# Altium schematic sheet Sheet2.SchDoc: Ulticontroller
size A3; CompanyName: Ultimaker; DrawnBy: Coen de Boer; Engineer: Coen de Boer; Revision: 1994-E
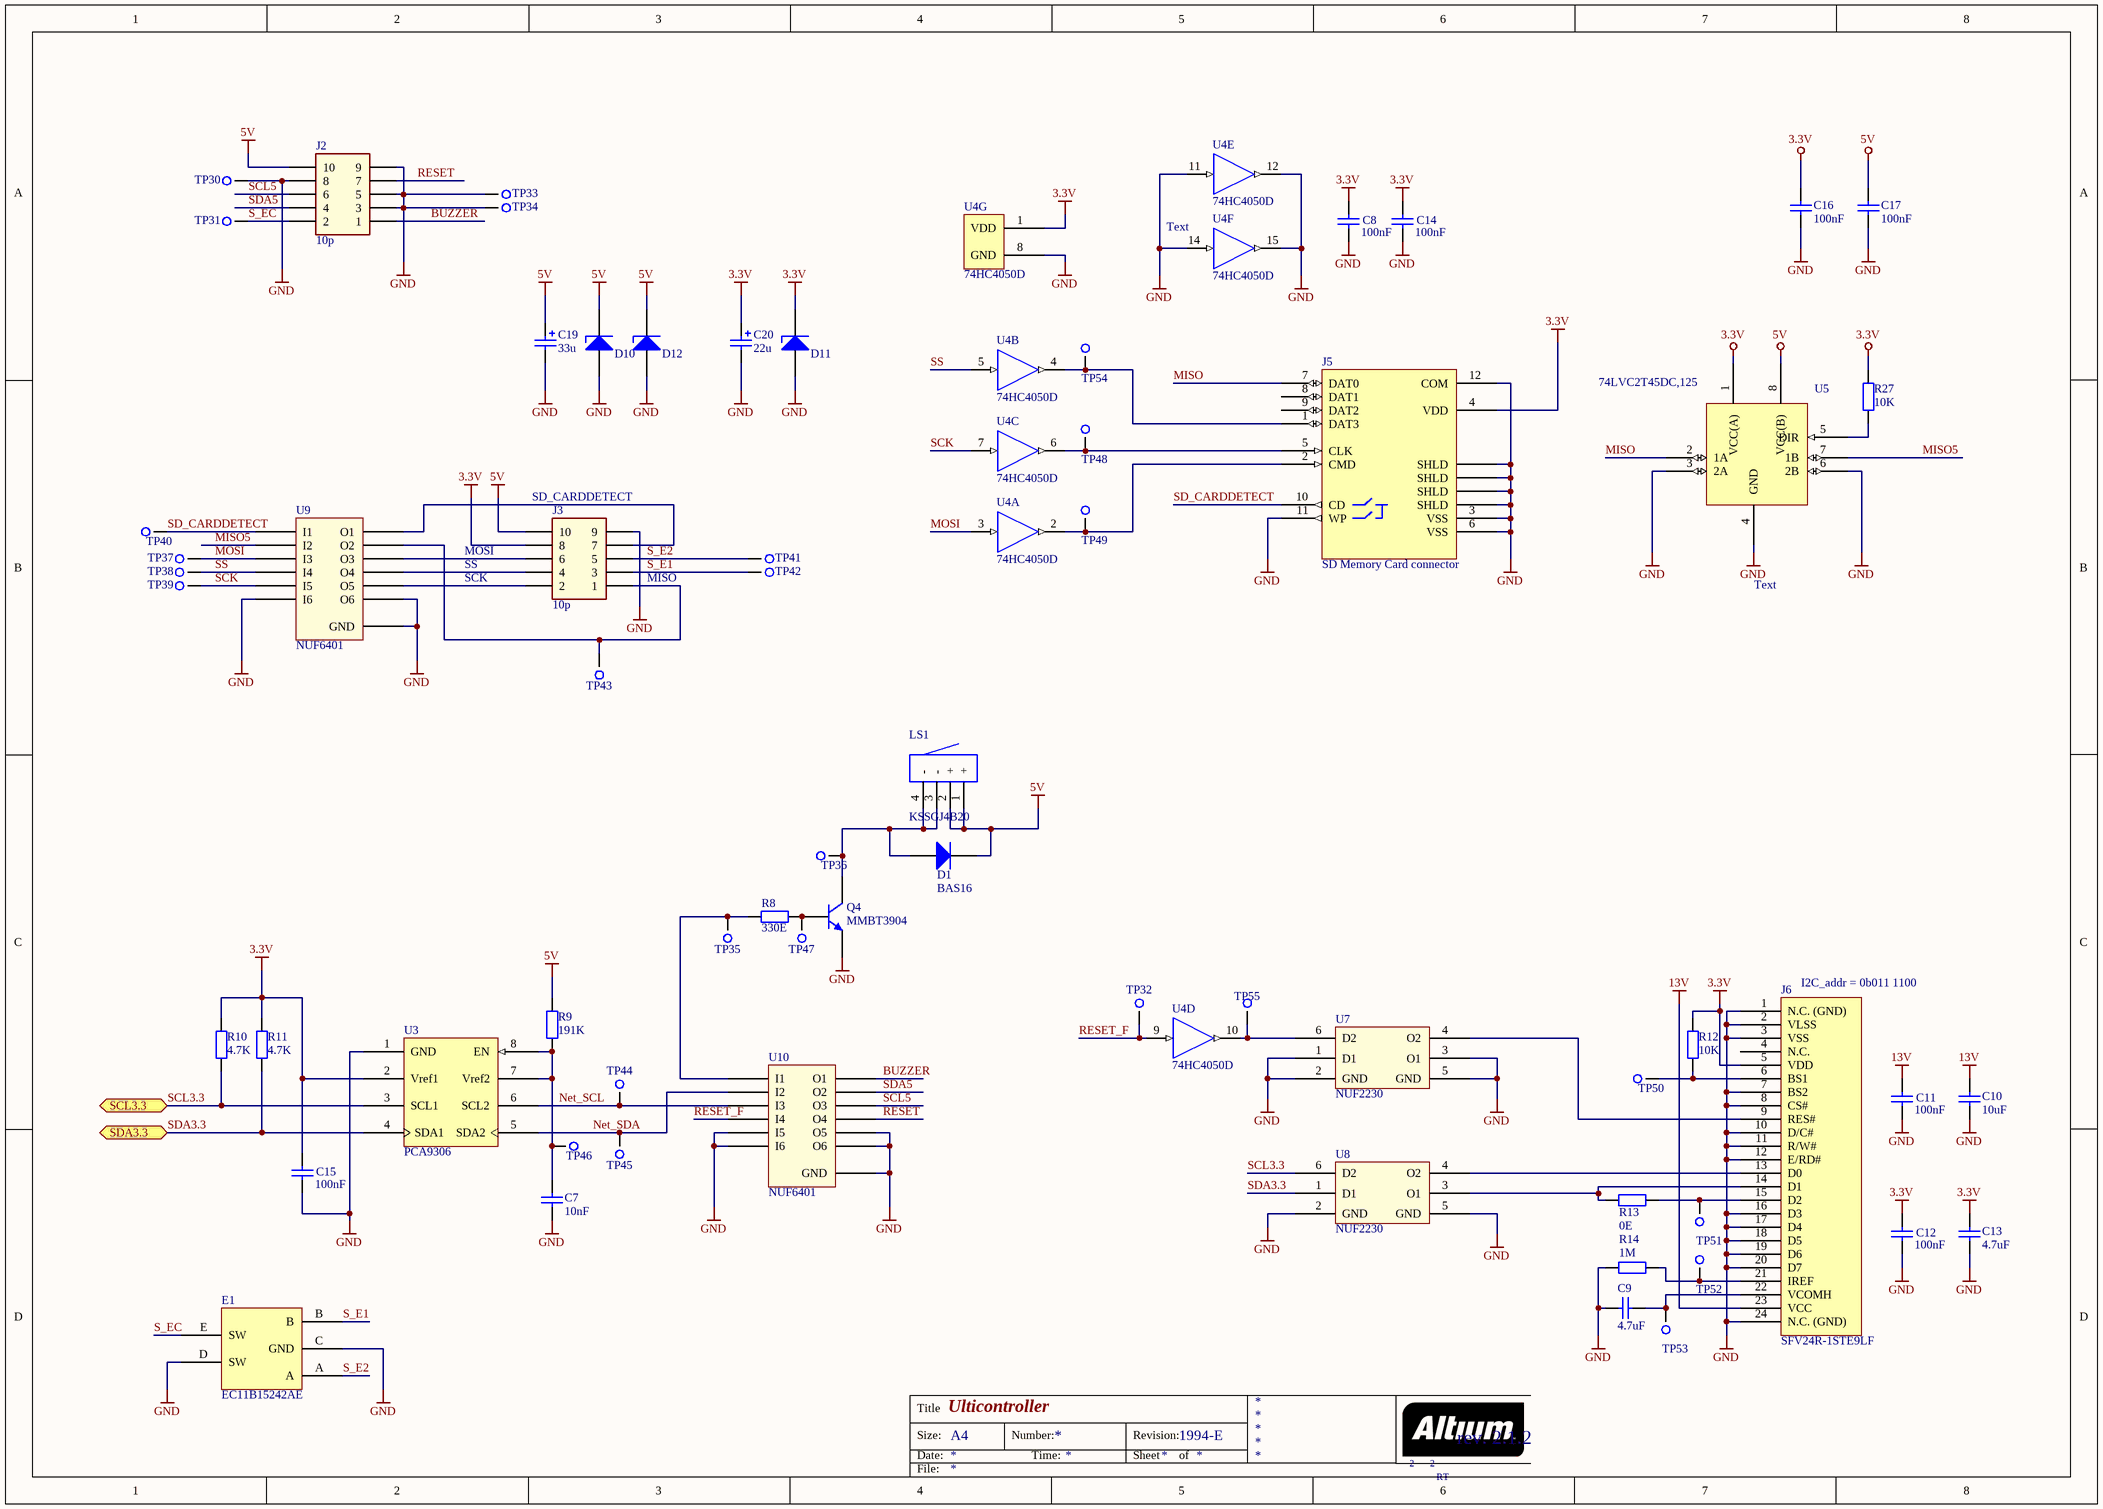
[diagram p0: Sheet2.SchDoc]

## Parts
C7  10nF  [C0805 (2012)]
C8  100nF  [C0805 (2012)]
C9  4.7uF  [C1206 (3216)]
C10  10uF  [C1206 (3216)]
C11  100nF  [C0805 (2012)]
C12  100nF  [C0805 (2012)]
C13  4.7uF  [C1206 (3216)]
C14  100nF  [C0805 (2012)]
C15  100nF  [C0805 (2012)]
C16  100nF  [C0805 (2012)]
C17  100nF  [C0805 (2012)]
C19  33u  [CAPAE5543X61M]
C20  22u  [CAPAE5543X61M]
D1  BAS16  [IC SOT23]
D10  ESD9X5.0ST5G  [SODFL100X40-2N]  (value not drawn)
D11  ESD9X3.3ST5G  [SODFL100X40-2N]  (value not drawn)
D12  ESD9X5.0ST5G  [SODFL100X40-2N]  (value not drawn)
E1  EC11B15242AE  [Misc EC11B15242AE]
J2  10p  [HEADER 10P right angle]
J3  10p  [HEADER 10P right angle]
J5  SD Memory Card connector  [CON SD-Card]
J6  SFV24R-1STE9LF  [Con SFV24R-1STE9LF]
LS1  KSSGJ4B20  [Buzzer KSSGJ4B20]
Q4  MMBT3904  [IC SOT23]
R8  330E  [R0805 (2012)]
R9  191K  [R0805 (2012)]
R10  4.7K  [R0805 (2012)]
R11  4.7K  [R0805 (2012)]
R12  10K  [R0805 (2012)]
R13  0E  [R0805 (2012)]
R14  1M  [R0805 (2012)]
R27  10K  [R0805 (2012)]
TP30  2mm  [TESTPOINT 2mm]  (value not drawn)  (no BOM)
TP31  2mm  [TESTPOINT 2mm]  (value not drawn)  (no BOM)
TP32  2mm  [TESTPOINT 2mm]  (value not drawn)  (no BOM)
TP33  2mm  [TESTPOINT 2mm]  (value not drawn)  (no BOM)
TP34  2mm  [TESTPOINT 2mm]  (value not drawn)  (no BOM)
TP35  2mm  [TESTPOINT 2mm]  (value not drawn)  (no BOM)
TP36  2mm  [TESTPOINT 2mm]  (value not drawn)  (no BOM)
TP37  2mm  [TESTPOINT 2mm]  (value not drawn)  (no BOM)
TP38  2mm  [TESTPOINT 2mm]  (value not drawn)  (no BOM)
TP39  2mm  [TESTPOINT 2mm]  (value not drawn)  (no BOM)
TP40  2mm  [TESTPOINT 2mm]  (value not drawn)  (no BOM)
TP41  2mm  [TESTPOINT 2mm]  (value not drawn)  (no BOM)
TP42  2mm  [TESTPOINT 2mm]  (value not drawn)  (no BOM)
TP43  2mm  [TESTPOINT 2mm]  (value not drawn)  (no BOM)
TP44  2mm  [TESTPOINT 2mm]  (value not drawn)  (no BOM)
TP45  2mm  [TESTPOINT 2mm]  (value not drawn)  (no BOM)
TP46  2mm  [TESTPOINT 2mm]  (value not drawn)  (no BOM)
TP47  2mm  [TESTPOINT 2mm]  (value not drawn)  (no BOM)
TP48  2mm  [TESTPOINT 2mm]  (value not drawn)  (no BOM)
TP49  2mm  [TESTPOINT 2mm]  (value not drawn)  (no BOM)
TP50  2mm  [TESTPOINT 2mm]  (value not drawn)  (no BOM)
TP51  2mm  [TESTPOINT 2mm]  (value not drawn)  (no BOM)
TP52  2mm  [TESTPOINT 2mm]  (value not drawn)  (no BOM)
TP53  2mm  [TESTPOINT 2mm]  (value not drawn)  (no BOM)
TP54  2mm  [TESTPOINT 2mm]  (value not drawn)  (no BOM)
TP55  2mm  [TESTPOINT 2mm]  (value not drawn)  (no BOM)
U3  PCA9306  [IC SSOP-8]
U4  74HC4050D  [IC SOIC-16]  (parts A,B,C,D,E,F,G of 7)
U5  74LVC2T45DC,125  [TSSOP50P310X100-8N]
U7  NUF2230  [SOTFL50P160X60-6N]
U8  NUF2230  [SOTFL50P160X60-6N]
U9  NUF6401  [SON50P140X100_HS-13N]
U10  NUF6401  [SON50P140X100_HS-13N]

## Ports
SCL3.3 (bidir), SDA3.3 (bidir)

## Nets
3.3V: C8.2 C12.2 C13.1 C14.2 C15.2 C16.1 C20.1 D11.1(K) J3.8 J5.4(VDD) J6.5(VDD) R10.2 R11.2 R12.2 R27.2 U3.2(Vref1) U4.1(VDD) U5.1(VCC(A))
5V: C17.1 C19.1 D1.3(K) D10.1(K) D12.1(K) J2.10 J3.10 LS1.1(+) LS1.2(+) R9.2 U5.8(VCC(B))
13V: C10.2 C11.2 J6.23(VCC)
GND: C7.1 C8.1 C9.2 C10.1 C11.1 C12.1 C13.2 C14.1 C15.1 C16.2 C17.2 C19.2 C20.2 D10.2(A) D11.2(A) D12.2(A) E1.C(GND) E1.D(SW) J2.3 J2.5 J2.8 J2.9 J3.9 J5.3(VSS) J5.6(VSS) J5.11(WP) J5.12(COM) J5.A(SHLD) J5.B(SHLD) J5.C(SHLD) J5.D(SHLD) J6.1(N.C._(GND)) J6.2(VLSS) J6.3(VSS) J6.7(BS2) J6.8(CS#) J6.10(D/C#) J6.11(R/W#) J6.12(E/RD#) J6.16(D3) J6.17(D4) J6.18(D5) J6.19(D6) J6.20(D7) J6.24(N.C._(GND)) Q4.2(E) R14.1 TP30.1 TP33.1 TP34.1 U3.1(GND) U4.8(GND) U4.11(A) U4.12(Y) U4.14(A) U4.15(Y) U5.3(2A) U5.4(GND) U5.6(2B) U7.1(D1) U7.2(GND) U7.3(O1) U7.5(GND) U8.2(GND) U8.5(GND) U9.6(I6) U9.7(O6) U9.13(GND) U10.5(I5) U10.6(I6) U10.7(O6) U10.8(O5) U10.13(GND)
BUZZER: J2.1 U10.12(O1)
MISO: J5.7(DAT0) U5.2(1A)
MISO5: U5.7(1B) U9.2(I2)
MOSI: TP37.1 U4.3(A) U9.3(I3)
Net_SCL: TP44.1 U3.6(SCL2) U10.3(I3)
Net_SDA: TP45.1 U3.5(SDA2) U10.2(I2)
RESET: J2.7 U10.9(O4)
RESET_F: TP32.1 U4.9(A) U10.4(I4)
S_E1: E1.B J3.3 TP42.1
S_E2: E1.A J3.5 TP41.1
S_EC: E1.E(SW) J2.2 TP31.1
SCK: TP39.1 U4.7(A) U9.5(I5)
SCL3.3: R10.1 U3.3(SCL1) U8.6(D2) ; port SCL3.3
SCL5: J2.6 U10.10(O3)
SD_CARDDETECT: J5.10(CD) TP40.1 U9.1(I1)
SDA3.3: R11.1 U3.4(SDA1) U8.1(D1) ; port SDA3.3
SDA5: J2.4 U10.11(O2)
SS: TP38.1 U4.5(A) U9.4(I4)
NetC7_2: C7.2 R9.1 TP46.1 U3.7(Vref2) U3.8(EN)
NetC9_1: C9.1 J6.22(VCOMH) TP53.1
NetD1_1: D1.1(A) LS1.3(-) LS1.4(-) Q4.3(C) TP36.1
NetJ3_1: J3.1 TP43.1 U9.11(O2)
NetJ3_2: J3.2 U9.8(O5)
NetJ3_4: J3.4 U9.9(O4)
NetJ3_6: J3.6 U9.10(O3)
NetJ3_7: J3.7 U9.12(O1)
NetJ5_1: J5.1(DAT3) TP54.1 U4.4(Y)
NetJ5_2: J5.2(CMD) TP49.1 U4.2(Y)
NetJ5_5: J5.5(CLK) TP48.1 U4.6(Y)
NetJ6_6: J6.6(BS1) R12.1 TP50.1
NetJ6_9: J6.9(RES#) U7.4(O2)
NetJ6_13: J6.13(D0) U8.4(O2)
NetJ6_14: J6.14(D1) R13.1 U8.3(O1)
NetJ6_15: J6.15(D2) R13.2 TP51.1
NetJ6_21: J6.21(IREF) R14.2 TP52.1
NetQ4_1: Q4.1(B) R8.2 TP47.1
NetR8_1: R8.1 TP35.1 U10.1(I1)
NetR27_1: R27.1 U5.5(DIR)
NetTP55_1: TP55.1 U4.10(Y) U7.6(D2)

Not connected (* = marked no-connect by the designer): J5 8(DAT1) 9(DAT2); J6 4(N.C.)

## Notes on the sheet
- (near U4) Text
- (near J3) SD_CARDDETECT
- MOSI
- SS
- SCK
- (near J3) MISO
- Text
- (near J6) I2C_addr = 0b011 1100
- rev. 2.1.2
- 2
- RT
- Title
- Size:
- Date:
- A4
- Number:
- Time:
- Revision:
- Sheet
- of
- File:

## Library data of the parts
C7 = Cap 10nF X7R 0805: Cap 10nF X7R 0805 10% 100V; Mfg: AVX; Mfg code: 08051C103K4Z2A; Faber ItemCode: -; Max soldering temp: -; Remarks: -; Supplier: Farnell; Supplier code: 1833850; SMD: Yes; Value: 10nF
C8 C11 C12 C14-C17 = Cap 100nF X7R 0805: Cap 100nF X7R 0805 10% 100V; Mfg: AVX; Mfg code: 08051C104K4T2A; Faber ItemCode: -; Max soldering temp: -; Remarks: -; Supplier: Farnell; Supplier code: 1833888; Value: 100nF; SMD: Yes
C9 C13 = Cap 4.7uF X7R 1206: Cap 4.7uF 1206 X7R 10% 25V; Mfg: TDK; Mfg code: C3216X7R1E475K160AC; Faber ItemCode: -; Max soldering temp: -; Remarks: -; Supplier: Farnell; Supplier code: 1907356; Value: 4.7uF; SMD: Yes
C10 = Cap 10uF X7R 1206: Cap 10uF 1206 X7R 10% 25V; Mfg: KEMET; Mfg code: C1206C106K3RAC TU; Faber ItemCode: -; Max soldering temp: -; Remarks: -; Supplier: Farnell; Supplier code: 2118134; Value: 10uF; SMD: Yes
C19 = Cap 33uF: CAP ALUM 33UF 20% 10V SMD; Mfg: Panasonic Electronic Components; Mfg code: EEE-FK1A330UR; Capacitance: 33µF; Lifetime @ Temp.: 2000 Hrs @ 105°C; Polarization: Polar; Ripple Current: 67.5mA @ 120Hz; Impedance: 1.35 Ohm; Surface Mount Land Size: 0.169" L x 0.169" W (4.30mm x 4.30mm); Supplier 1: Digi-Key; Supplier Part Number 1: PCE3778TR-ND; RoHS: RoHS Compliant; Category: Capacitors; Stock: 18000; Pricing: 2000=0.07952, 4000=0.0751, 10000=0.07068, 14000=0.06847, 50000=0.06185, 100000=0.05743 (EUR); Packaging: Tape & Reel (TR); Tolerance: ±20%; Voltage Rating: 10V; ESR (Equivalent Series Resistance): -; Operating Temperature: -55°C ~ 105°C; Applications: General Purpose; Lead Spacing: -; Size / Dimension: 0.157" Dia (4.00mm); Height - Seated (Max): 0.228" (5.80mm); Mounting Type: Surface Mount; Package / Case: Radial, Can - SMD; ComponentLink1URL: http://industrial.panasonic.com/www-cgi/jvcr13pz.cgi?E+PZ+3+ABA0120+EEEFK1A330UR+7+WW; ComponentLink1Description: http://industrial.panasonic.com/www-cgi/jvcr13pz.cgi?E+PZ+3+ABA0120+EEEFK1A330UR+7+WW
C20 = Cap 22uF: CAP ALUM 22UF 20% 6.3V SMD; Mfg: Panasonic Electronic Components; Mfg code: EEV-HB0J220R; Capacitance: 22µF; Lifetime @ Temp.: 2000 Hrs @ 105°C; Polarization: Polar; Ripple Current: 26mA @ 120Hz; Surface Mount Land Size: 0.169" L x 0.169" W (4.30mm x 4.30mm); Supplier 1: Digi-Key; Supplier Part Number 1: PCE3026TR-ND; RoHS: RoHS non-compliant; Category: Capacitors; Stock: 10000; Pricing: 2000=0.06791, 4000=0.06413, 10000=0.06036 (EUR); Packaging: Tape & Reel (TR); Tolerance: ±20%; Voltage Rating: 6.3V; ESR (Equivalent Series Resistance): -; Operating Temperature: -40°C ~ 105°C; Applications: General Purpose; Impedance: -; Lead Spacing: -; Size / Dimension: 0.157" Dia (4.00mm); Height - Seated (Max): 0.228" (5.80mm); Mounting Type: Surface Mount; Package / Case: Radial, Can - SMD; ComponentLink1URL: http://media.digikey.com/pdf/Data%20Sheets/Panasonic%20Capacitors%20PDFs/EEV-HB%20(HB%20Series).pdf; ComponentLink1Description: http://media.digikey.com/pdf/Data%20Sheets/Panasonic%20Capacitors%20PDFs/EEV-HB%20(HB%20Series).pdf
D1 = Diode BAS16: Diode BAS16  SOT23 85V 215MA; Mfg: NXP; Faber ItemCode: -; Max soldering temp: -; Mfg code: BAS16; Remarks: -; SMD: Yes; Supplier: Farnell; Supplier code: 1081180; Value: -
D10 D12 = ESD9X5.0ST5G: TVS DIODE 5VWM 12.3VC SOD923; Mfg: ON Semiconductor; Type: Zener; Unidirectional Channels: 1; Voltage - Reverse Standoff (Typ): 5V (Max); Voltage - Breakdown (Min): 6.2V; Voltage - Clamping (Max) @ Ipp: 12.3V; Current - Peak Pulse (10/1000µs): 8.7A (8/20µs); Power - Peak Pulse: 107W; Power Line Protection: No; Capacitance @ Frequency: 65pF @ 1MHz; Supplier 1: Digi-Key; Supplier Part Number 1: ESD9X5.0ST5GOSTR-ND; Mfg code: ESD9X5.0ST5G; RoHS: RoHS Compliant; Category: Circuit Protection; Stock: 40000; Pricing: 8000=0.02337, 16000=0.02032, 24000=0.01829, 56000=0.01626, 200000=0.01351 (EUR); Packaging: Tape & Reel (TR); Bidirectional Channels: -; Applications: General Purpose; Operating Temperature: -55°C ~ 150°C (TJ); Mounting Type: Surface Mount; Package / Case: SOD-923; Supplier Device Package: SOD-923; ComponentLink1URL: http://www.onsemi.com/pub_link/Collateral/ESD9X3.3ST5G-D.PDF; ComponentLink1Description: http://www.onsemi.com/pub_link/Collateral/ESD9X3.3ST5G-D.PDF
D11 = ESD9X3.3ST5G: TVS DIODE 3.3VWM 10.4VC SOD923; Mfg: ON Semiconductor; Type: Zener; Unidirectional Channels: 1; Voltage - Reverse Standoff (Typ): 3.3V (Max); Voltage - Breakdown (Min): 5V; Voltage - Clamping (Max) @ Ipp: 10.4V; Current - Peak Pulse (10/1000µs): 9.8A (8/20µs); Power - Peak Pulse: 102W; Power Line Protection: No; Capacitance @ Frequency: 80pF @ 1MHz; Supplier 1: Digi-Key; Supplier Part Number 1: ESD9X3.3ST5GOSTR-ND; Mfg code: ESD9X3.3ST5G; RoHS: RoHS Compliant; Category: Circuit Protection; Stock: 136000; Pricing: 8000=0.03287, 16000=0.02794, 24000=0.02629, 56000=0.02465, 200000=0.02136 (EUR); Packaging: Tape & Reel (TR); Bidirectional Channels: -; Applications: Automotive; Operating Temperature: -55°C ~ 150°C (TJ); Mounting Type: Surface Mount; Package / Case: SOD-923; Supplier Device Package: SOD-923; ComponentLink1URL: http://www.onsemi.com/pub_link/Collateral/ESD9X3.3ST5G-D.PDF; ComponentLink1Description: http://www.onsemi.com/pub_link/Collateral/ESD9X3.3ST5G-D.PDF
E1 = Misc EC11B15242AE: Misc EC11B15242AE encoder horiz; Mfg: ALPS; Faber ItemCode: -; Max soldering temp: -; Mfg code: EC11B15242AE; Remarks: -; SMD: No; Supplier: Farnell; Supplier code: 2064978; Value: -
J2 J3 = Header 10p: Header 2x5p right angle 2.54mm; Mfg: WURTH ELEKTRONIK; Mfg code: 61201021721; Value: -; Faber ItemCode: -; Max soldering temp: -; Remarks: -; SMD: No; Supplier: Farnell; Supplier code: 1642023
J5 = Connector SD-Card-Hirose: Connector Std,reverse SD Memory Card connector; Faber ItemCode: 36966100; Mfg: HRS (HIROSE); Mfg code: DM1AA-SF-PEJ(72); Faber Artikelomschrijving: SD-KAARDHOUDER SMD DM1AA-SF-PEJ(72) HIROSE; Bestel grote: 1; Prijs: 3,02; Value: -; Max soldering temp: -; Remarks: -; SMD: Yes; Supplier: Mouser; Supplier code: 798-DM1AA-SF-PEJ72
J6 = Connector SFV24R-1STE9LF: Connector FPC/FFC 0.5mm R/A 24p SMD; Mfg: FCI; Faber ItemCode: -; Max soldering temp: -; Mfg code: SFV24R-1STE9LF; Remarks: -; SMD: Yes; Supplier: Farnell; Supplier code: 1830598; Value: -
LS1 = Buzzer KSSGJ4B20: Buzzer KSSGJ4B20 SMD; Mfg: KINGSTATE; Faber ItemCode: -; Max soldering temp: -; Mfg code: KSSGJ4B20; Remarks: -; SMD: Yes; Supplier: Farnell; Supplier code: 1502710; Value: -
Q4 = NPN MMBT3904: NPN MMBT3904 SOT-23 200mA; Mfg: NXP; Mfg code: MMBT3904,215; Faber ItemCode: -; Max soldering temp: -; Remarks: -; Supplier: Farnell; Supplier code: 1757935; Value: -; SMD: Yes
R8 = Res 330E 0805: Res 330E 0805 1% 100mW; Mfg: MULTICOMP; Mfg code: MC 0.1W 0805 1% 330R; Faber ItemCode: -; Max soldering temp: -; Remarks: -; Supplier: Farnell; Supplier code: 9333037; Value: 330E; SMD: Yes
R9 = Res 191K 0805: Res 191K 0805 1% 125mW; Mfg: VISHAY DRALORIC; Mfg code: CRCW0805191KFKEA; Faber ItemCode: -; Max soldering temp: -; Remarks: -; Supplier: Farnell; Supplier code: 2139049; Value: 191K; SMD: Yes
R10 R11 = Res 4.7K 0805: Res 4.7K 0805 1% 100mW; Mfg: MULTICOMP; Mfg code: MC 0.1W 0805 1% 4K7; Faber ItemCode: -; Max soldering temp: -; Remarks: -; Supplier: Farnell; Supplier code: 9333266; Value: 4.7K; SMD: Yes
R12 R27 = Res 10K 0805: Res 10K 0805 1% 100mW; Mfg: MULTICOMP; Mfg code: MC 0.1W 0805 1% 10K; Faber ItemCode: -; Max soldering temp: -; Remarks: -; Supplier: Farnell; Supplier code: 9332391; Value: 10K; SMD: Yes
R13 = Res 0E 0805: Res 0E 0805 1% 100mW; Mfg: MULTICOMP; Mfg code: MC 0.1W 0805 0R; Faber ItemCode: -; Max soldering temp: -; Remarks: -; Supplier: Farnell; Supplier code: 9333681; Value: 0E; SMD: Yes
R14 = Res 1M 0805: Res 1M 0805 1% 100mW; Mfg: MULTICOMP; Mfg code: MC 0.1W 0805 1% 1M; Faber ItemCode: -; Max soldering temp: -; Remarks: -; Supplier: Farnell; Supplier code: 9332413; Value: 1M; SMD: Yes
TP30-TP55 = Testpoint, 2mm, round: Remarks: Not a component; Faber ItemCode: -; Mfg: -; Mfg code: -; Value: -; Supplier: -; Supplier code: -; Max soldering temp: -
U3 = IC PCA9306: IC PCA9306 Voltage Level translator; Mfg: TEXAS INSTRUMENTS; Mfg code: PCA9306DCTR; Faber ItemCode: -; Max soldering temp: -; Remarks: -; SMD: Yes; Supplier: Farnell; Supplier code: 1470936; Value: -
U4 = IC 74HC4050D: IC Hex Non-Inverting Buffer/Logic-Level Down Converter; Faber ItemCode: 35592900; Mfg: NXP; Faber Artikelomschrijving: IC 74HC4050D SO-16 NXP; Bestel grote: 2500; Prijs: 0,0878; Max soldering temp: -; Mfg code: 74HC4050D; Remarks: -; SMD: Yes; Supplier: Arrow CE GmbH; Supplier code: 74HC4050D,653 (T&R); Value: -
U5 = 74LVC2T45DC,125: 2-bit translaing transceiver; Mfg: NXP; Mfg code: 74LVC2T45DC,125; Supplier: Farnell; Supplier code: 2444915
U7 U8 = NUF2230: Mfg: ON Semiconductor; Mfg code: NUF2230XV6T1G; Filter Order: 2nd; Number of Channels: 2; Center / Cutoff Frequency: 125MHz (Cutoff); Attenuation Value: 30dB @ 800MHz ~ 900MHz; Resistance - Channel (Ohms): 100; Values: R = 100 Ohms, C = 16pF; ESD Protection: Yes; Supplier 1: Digi-Key; Supplier Part Number 1: NUF2230XV6T1GOSCT-ND; RoHS: RoHS Compliant; Category: Filters; Stock: 3048; Pricing: 1=0.27, 10=0.252, 25=0.2404, 50=0.2326, 100=0.2248, 250=0.21316, 500=0.17828, 1000=0.13836 (EUR); Packaging: Cut Tape (CT); Type: Low Pass; Technology: RC (Pi); Current: -; Operating Temperature: -40°C ~ 85°C; Applications: Data Lines for Mobile Devices; Package / Case: SOT-563, SOT-666; Size / Dimension: 0.063" L x 0.047" W (1.60mm x 1.20mm); Height: 0.024" (0.60mm); ComponentLink1URL: http://www.onsemi.com/pub_link/Collateral/NUF2230XV6-D.PDF; ComponentLink1Description: http://www.onsemi.com/pub_link/Collateral/NUF2230XV6-D.PDF
U9 U10 = NUF6401: Mfg: ON Semiconductor; Mfg code: NUF6401MNT1G; Filter Order: 2nd; Number of Channels: 6; Center / Cutoff Frequency: 110MHz (Cutoff); Attenuation Value: 30dB @ 800MHz ~ 3GHz; Resistance - Channel (Ohms): 100; Values: R = 100 Ohms, C = 17pF; ESD Protection: Yes; Supplier 1: Digi-Key; Supplier Part Number 1: NUF6401MNT1GOSTR-ND; RoHS: RoHS Compliant; Category: Filters; Stock: 6000; Pricing: 3000=0.13931, 6000=0.13111, 15000=0.12292, 30000=0.11472 (EUR); Packaging: Tape & Reel (TR); Type: Low Pass; Technology: RC (Pi); Current: -; Operating Temperature: -40°C ~ 85°C; Applications: Data Lines for Mobile Devices; Package / Case: 12-VFDFN Exposed Pad; Size / Dimension: 0.118" L x 0.053" W (3.00mm x 1.35mm); Height: 0.039" (1.00mm); ComponentLink1URL: http://www.onsemi.cn/pub_link/Collateral/NUF6401-D.PDF; ComponentLink1Description: http://www.onsemi.cn/pub_link/Collateral/NUF6401-D.PDF